# EasyEDA Pro project ProProject_BackupProjects_martinnohr_personal_1_20240117_2024-01-16.epro

# Schematic MIW PS on PCB

## Sheets
1 TTGO_CIRCUIT_PCB_UNIFIED
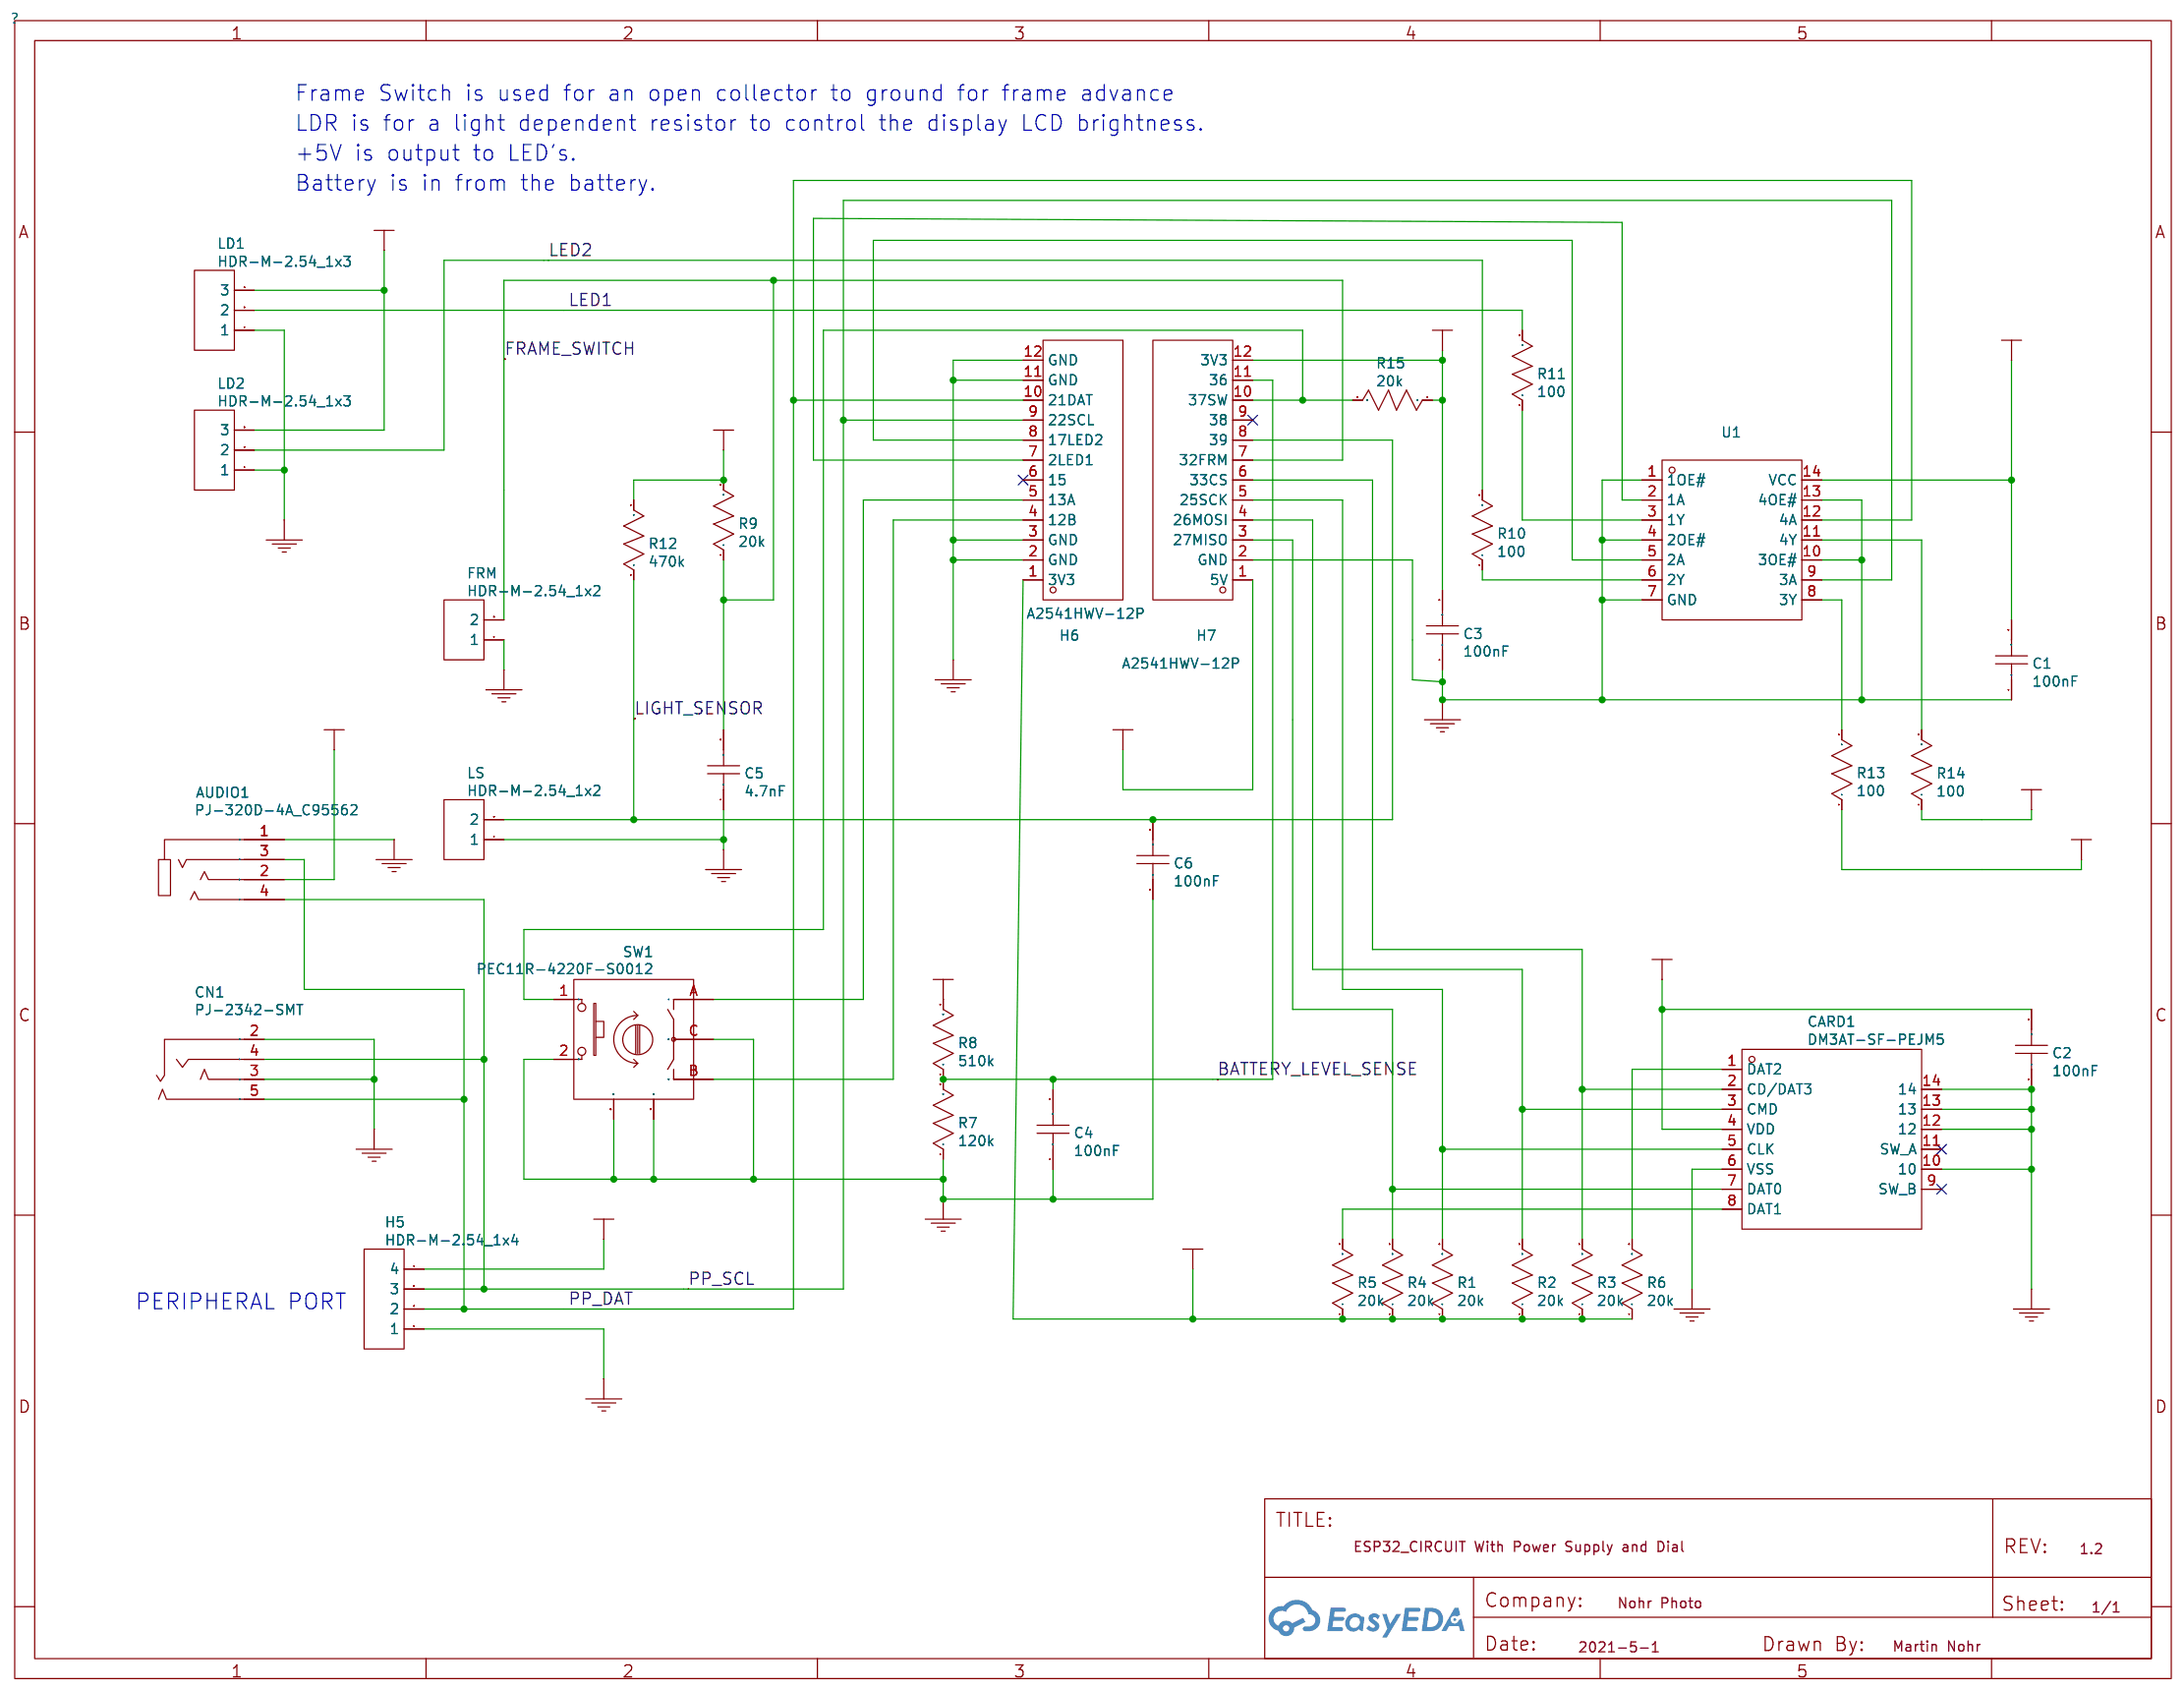
[diagram p0: TTGO_CIRCUIT_PCB_UNIFIED]
2 Power Supply Circuit
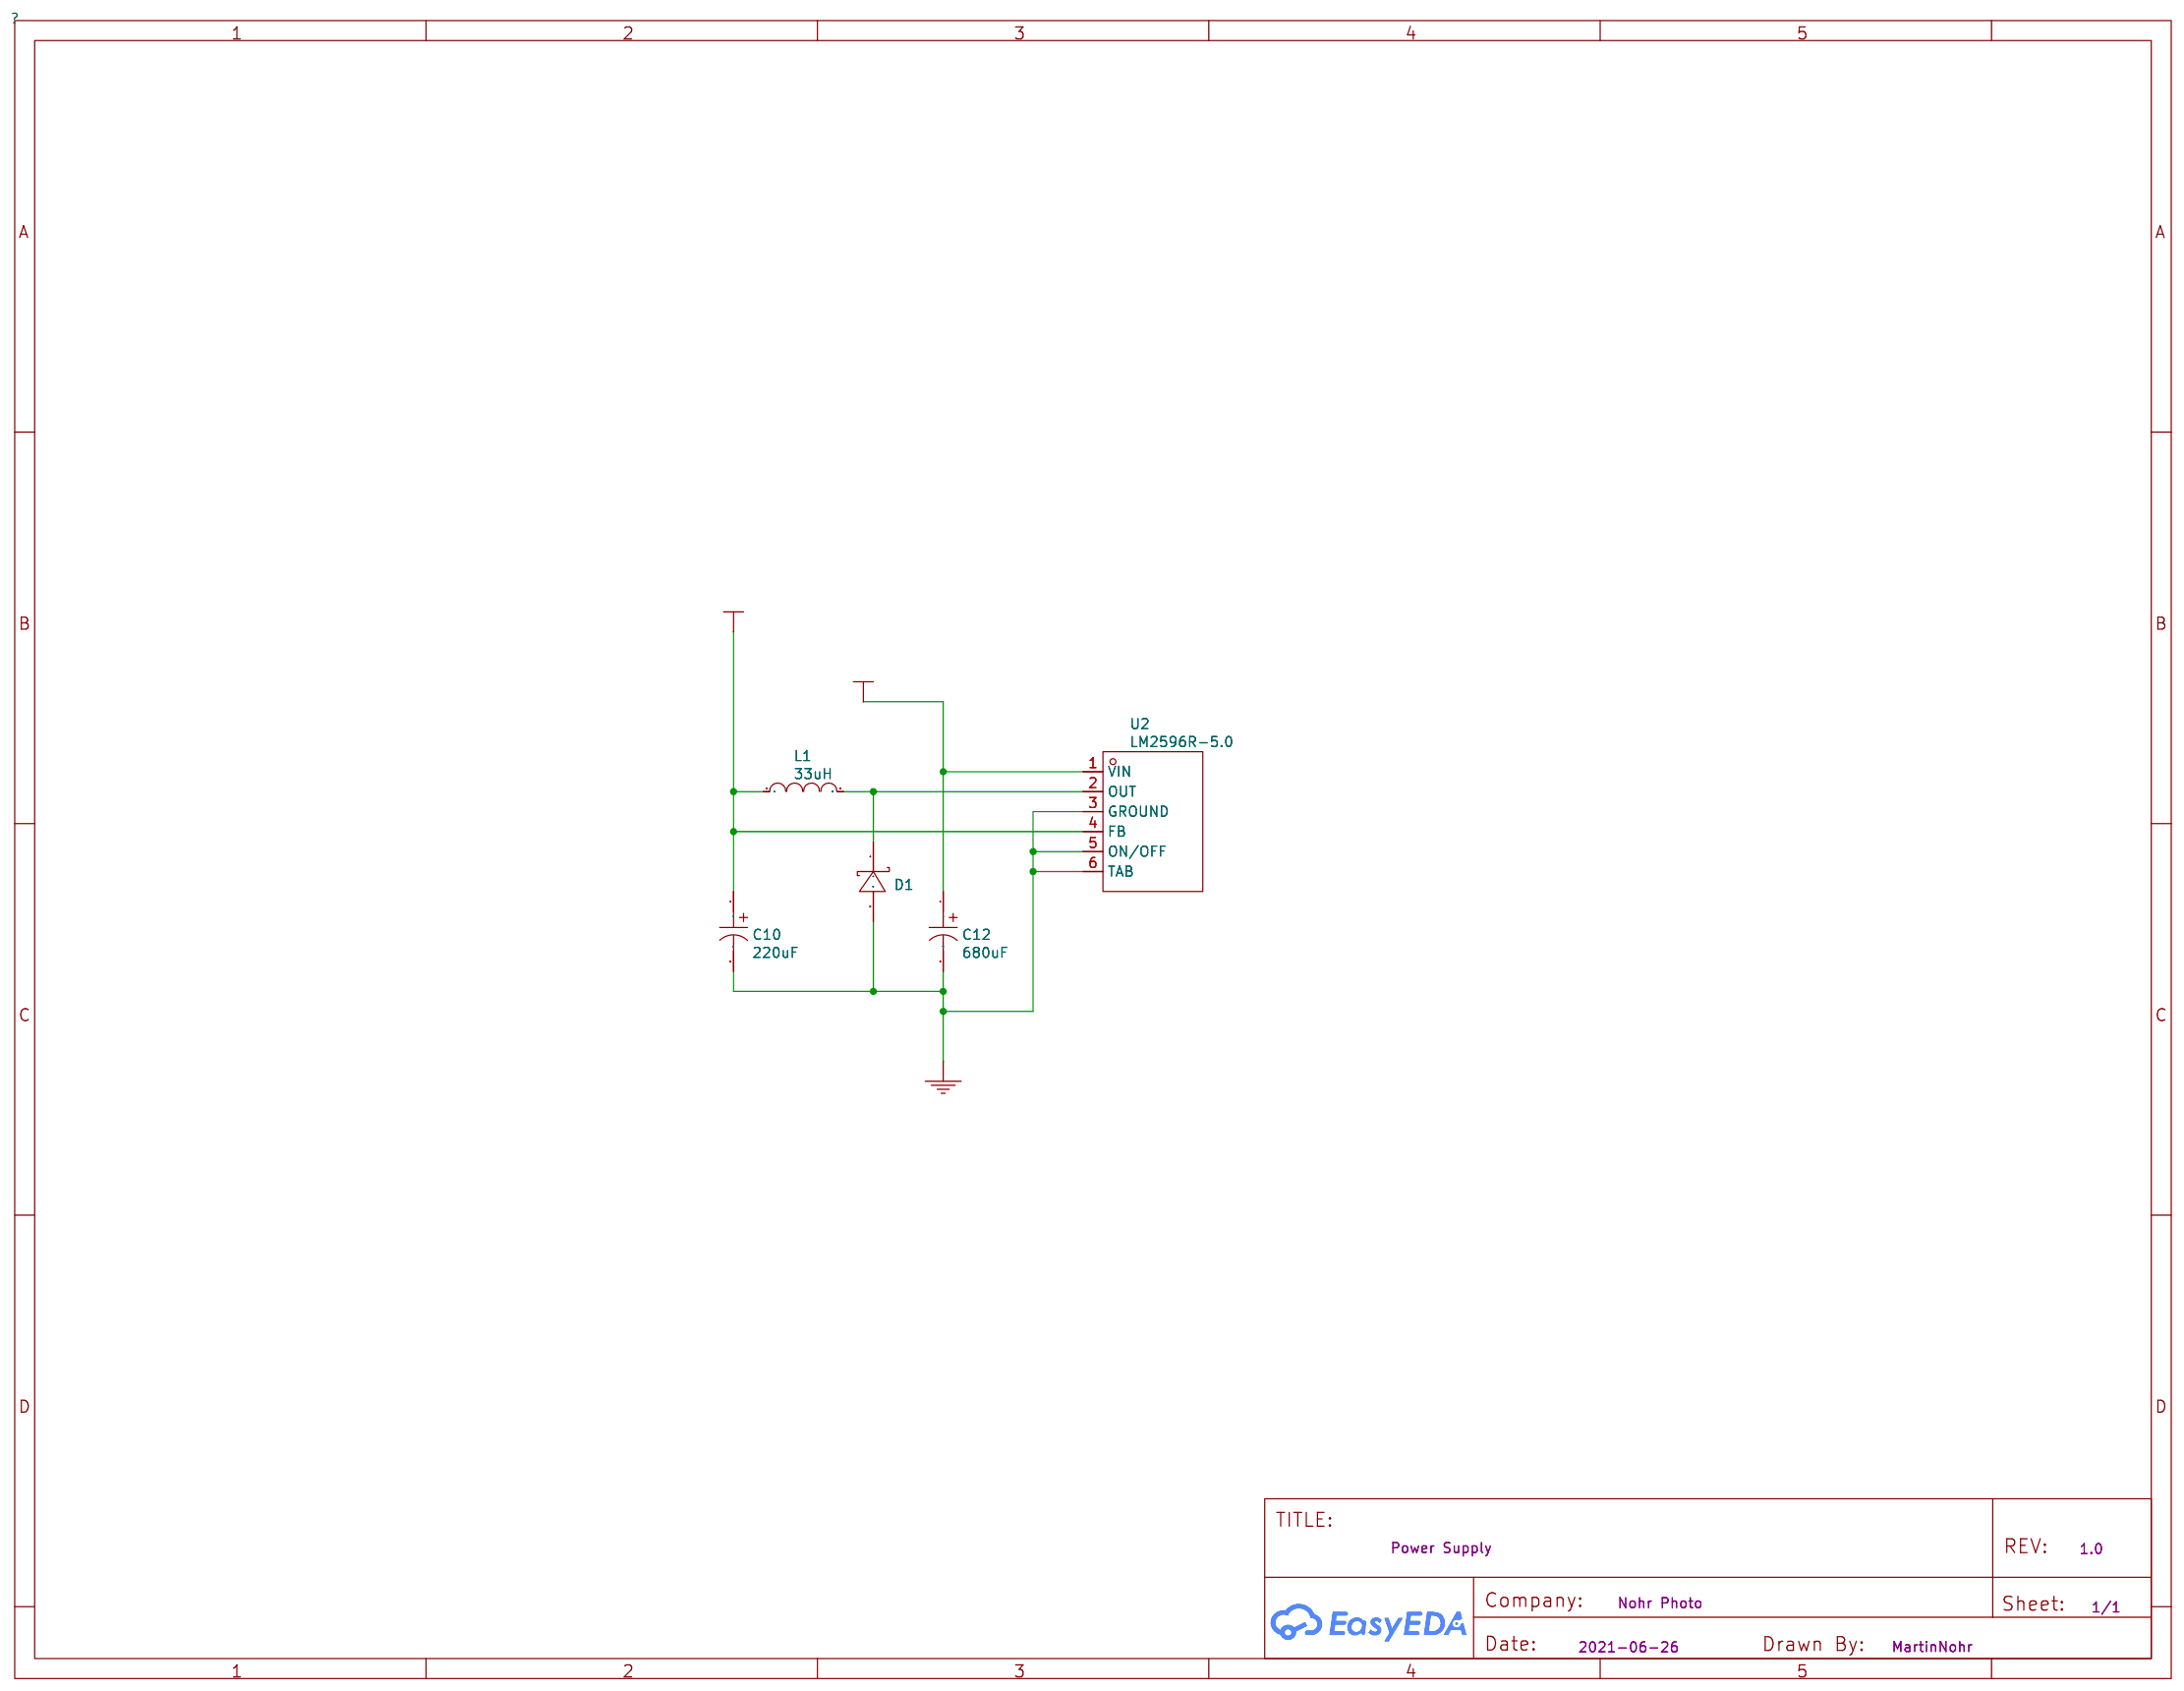
[diagram p1: Power Supply Circuit]

## Parts
sheet Power Supply Circuit
C10  220uF  [CAP-TH_BD5.0-P2.00-D0.8-FD]
C12  680uF  [CAP-TH_BD8.0-P3.50-D0.6-FD]
D1  B2100-13-F  [SMB_L4.6-W3.6-LS5.3-RD]
L1  33uH  [IND-SMD_L11.5-W10.0_SMMS1040]
U2  LM2596R-5.0  [TO-263-5_L10.2-W8.6-P1.70-LS14.4-TL]
sheet TTGO_CIRCUIT_PCB_UNIFIED
AUDIO1  PJ-320D-4A_C95562  [AUDIO-SMD_PJ-320D-4A]
C1  100nF  [C0603]
C2  100nF  [C0603]
C3  100nF  [C0603]
C4  100nF  [C0603]
C5  4.7nF  [C0603]
C6  100nF  [C0603]
CARD1  DM3AT-SF-PEJM5  [SD-SMD_DM3AT-SF-PEJM5]
CN1  PJ-2342-SMT  [AUDIO-SMD_PJ-2342-SMT]
FRM  HDR-M-2.54_1x2  [HDR-M-2.54_1X2]  (no BOM)
H5  HDR-M-2.54_1x4  [HDR-M-2.54_1X4]  (no BOM)
H6  A2541HWV-12P  [HDR-TH_12P-P2.54-V_A2541HWV-12P]
H7  A2541HWV-12P  [HDR-TH_12P-P2.54-V_A2541HWV-12P]
LD1  HDR-M-2.54_1x3  [HDR-M-2.54_1X3]  (no BOM)
LD2  HDR-M-2.54_1x3  [HDR-M-2.54_1X3]  (no BOM)
LS  HDR-M-2.54_1x2  [HDR-M-2.54_1X2]  (no BOM)
R1  20k  [R0603]
R2  20k  [R0603]
R3  20k  [R0603]
R4  20k  [R0603]
R5  20k  [R0603]
R6  20k  [R0603]
R7  120k  [R0603]
R8  510k  [R0603]
R9  20k  [R0603]
R10  100  [R0603]
R11  100  [R0603]
R12  470k  [R0603]
R13  100  [R0603]
R14  100  [R0603]
R15  20k  [R0603]
SW1  PEC11R-4220F-S0012  [SW-TH_PEC11R-4XXXF-SXXXX]
U1  74HCT125PW,112  [TSSOP-14_L5.0-W4.4-P0.65-LS6.4-BL]

## Library data of the parts
C10 = 220uF: link: https://item.szlcsc.com/44805.html; 3DModel: CAP-TH_D5.0×H7.0×P2.0; Supplier: LCSC; Supplier Part: C43340; Manufacturer: ValuePro; Manufacturer Part: KS227M016E07RR0VH2FP0; JLCPCB Part Class: Extended Part
C12 = 680uF: link: https://atta.szlcsc.com/upload/public/pdf/source/20151029/1457707523808.pdf; 3DModel: CAP-TH_D8.0-H8.0-P3.50; Supplier: LCSC; Supplier Part: C698148; Manufacturer: Yunxing; Manufacturer Part: SPT1EM681F12OR; JLCPCB Part Class: Extended Part
D1 = B2100-13-F: link: https://item.szlcsc.com/288502.html; Supplier: LCSC; Manufacturer: DIODES; Supplier Part: C110479; JLCPCB Part Class: Extended Part
L1 = 33uH: link: https://item.szlcsc.com/160923.html; 3DModel: IND-SMD_L11.5-W10.0-H4.0; Supplier: LCSC; Supplier Part: C497900; Manufacturer: YJYCOIN; Manufacturer Part: YSPI1050-330M
U2 = LM2596R-5.0: link: https://item.szlcsc.com/139878.html; 3DModel: TO-263-5-5P_L10.2-W8.7-H4.5-LS14.4-P1.70; Supplier: LCSC; Manufacturer: HTC; Supplier Part: C77782; JLCPCB Part Class: Extended Part
AUDIO1 = PJ-320D-4A_C95562: link: https://atta.szlcsc.com/upload/public/pdf/source/20191118/C95562_44BBA17C3716211451436BE670A801EE.pdf; 3DModel: AUDIO-SMD_L12.1-W6.1-H5.0-4P; Supplier: LCSC; Supplier Part: C95562; Manufacturer: Rectangular Connectors - Contacts; Manufacturer Part: PJ-320D-4A; JLCPCB Part Class: Extended Part
C1-C4 C6 = 100nF: link: https://item.szlcsc.com/362304.html; 3DModel: C0603_L1.6-W0.8-H0.8; Supplier: LCSC; Supplier Part: C15725; Manufacturer: SAMSUNG; Manufacturer Part: CL10B104KC8NNNC
C5 = 4.7nF: Supplier: LCSC; Supplier Part: C106218; Manufacturer: YAGEO; Manufacturer Part: CC0603KRX7R9BB472
CARD1 = DM3AT-SF-PEJM5: Supplier: LCSC; Supplier Part: C114218; Manufacturer: Hirose; link: https://item.szlcsc.com/115458.html
CN1 = PJ-2342-SMT: link: https://item.szlcsc.com/378934.html; 3DModel: AUDIO-SMD_L10.0-W5.0-H3.3-4P; Supplier: LCSC; Supplier Part: C397356; Manufacturer: XKB Enterprise; JLCPCB Part Class: Extended Part
FRM LS = HDR-M-2.54_1x2: Supplier Part: C124375; Supplier: LCSC
H5 = HDR-M-2.54_1x4: Supplier Part: C124378; Supplier: LCSC
H6 H7 = A2541HWV-12P: Supplier: LCSC; Supplier Part: C225509; Manufacturer: Changjiang Connectors; JLCPCB Part Class: Extend; 3DModel: 12SIP-Header
LD1 LD2 = HDR-M-2.54_1x3: Supplier Part: C180248; Supplier: LCSC
R1-R6 R9 R15 = 20k: link: https://item.szlcsc.com/137208.html; 3DModel: R0603_L1.6-W0.8-H0.8; Supplier Part: C4184; Supplier: LCSC; Manufacturer Part: 0603WAF2002T5E; Manufacturer: UniOhm
R7 = 120k: link: https://item.szlcsc.com/137208.html; 3DModel: R0603_L1.6-W0.8-H0.8; Supplier Part: C25808; Supplier: LCSC; Manufacturer Part: 0603WAF1203T5E; Manufacturer: UniOhm
R8 = 510k: link: https://item.szlcsc.com/137208.html; 3DModel: R0603_L1.6-W0.8-H0.8; Supplier Part: C23192; Supplier: LCSC; Manufacturer Part: 0603WAF5103T5E; Manufacturer: UniOhm
R10 R11 R13 R14 = 100: link: https://item.szlcsc.com/137208.html; 3DModel: R0603_L1.6-W0.8-H0.8; Supplier Part: C22775; Supplier: LCSC; Manufacturer Part: 0603WAF1000T5E; Manufacturer: UniOhm
R12 = 470k: link: https://item.szlcsc.com/137208.html; 3DModel: R0603_L1.6-W0.8-H0.8; Supplier Part: C23178; Supplier: LCSC; Manufacturer Part: 0603WAF4703T5E; Manufacturer: UniOhm
SW1 = PEC11R-4220F-S0012: Supplier: LCSC; Supplier Part: C143817; Manufacturer: BOURNS
U1 = 74HCT125PW,112: link: https://item.szlcsc.com/8137.html; 3DModel: TSSOP-14_L5.0-W4.4-H1.0-LS6.4-P0.65; Supplier: LCSC; Supplier Part: C545657; Manufacturer: Nexperia; JLCPCB Part Class: Extended Part

## Nets
+5V: C1.2 C10.1 H7.1(5V) L1.1 LD1.3 LD2.3 U1.14(VCC) U2.4(FB)
GND: AUDIO1.1 C1.1 C2.1 C3.1 C4.1 C5.1 C6.1 C10.2 C12.2 CARD1.6(VSS) CARD1.10 CARD1.12 CARD1.13 CARD1.14 CN1.2 CN1.3 D1.2 FRM.1 H5.1 H6.2(GND) H6.3(GND) H6.11(GND) H6.12(GND) H7.2(GND) LD1.1 LD2.1 LS.1 R7.1 SW1.2 SW1.C SW1.MT1 SW1.MT2 U1.1(1OE#) U1.4(2OE#) U1.7(GND) U1.10(3OE#) U1.13(4OE#) U2.3(GROUND) U2.5(ON/OFF) U2.6(TAB)
VCC: AUDIO1.2 C2.2 C3.2 CARD1.4(VDD) H5.4 H6.1(3V3) H7.12(3V3) R1.1 R2.1 R3.1 R4.1 R5.1 R6.1 R9.2 R12.2 R15.1
BATTERY: C12.1 R8.2 U2.1(VIN)
BATTERY_LEVEL_SENSE: C4.2 H7.11(36) R7.2 R8.1
FRAME_SWITCH: C5.2 FRM.2 H7.7(32FRM) R9.1
LED1: LD1.2 R11.2
LED2: LD2.2 R10.2
LED3: R13.1
LED4: R14.1
LIGHT_SENSOR: C6.2 H7.8(39) LS.2 R12.1
PP_DAT: AUDIO1.3 CN1.5 H5.2 H6.10(21DAT) U1.12(4A)
PP_SCL: AUDIO1.4 CN1.4 H5.3 H6.9(22SCL) U1.9(3A)
CARD1_1: CARD1.1(DAT2) R6.2
CARD1_2: CARD1.2(CD/DAT3) H7.6(33CS) R3.2
CARD1_3: CARD1.3(CMD) H7.4(26MOSI) R2.2
CARD1_5: CARD1.5(CLK) H7.5(25SCK) R1.2
CARD1_7: CARD1.7(DAT0) H7.3(27MISO) R4.2
CARD1_8: CARD1.8(DAT1) R5.2
H6_7: H6.7(2LED1) U1.2(1A)
H6_8: H6.8(17LED2) U1.5(2A)
R10_1: R10.1 U1.6(2Y)
R11_1: R11.1 U1.3(1Y)
SW1_1: H7.10(37SW) R15.2 SW1.1
SW1_A: H6.5(13A) SW1.A
SW1_B: H6.4(12B) SW1.B
U1_8: R13.2 U1.8(3Y)
U1_11: R14.2 U1.11(4Y)
U2_2: D1.1 L1.2 U2.2(OUT)

Not connected (* = marked no-connect by the designer): CARD1 9(SW_B)* 11(SW_A)*; H6 6(15)*; H7 9(38)*

## Notes on the sheets
sheet 1
- Frame Switch is used for an open collector to ground for frame advance
- LDR is for a light dependent resistor to control the display LCD brightness.
- +5V is output to LED's.
- Battery is in from the battery.
- PERIPHERAL PORT

# Board 1-PCB_TTGO MIW PCB UNIFIED
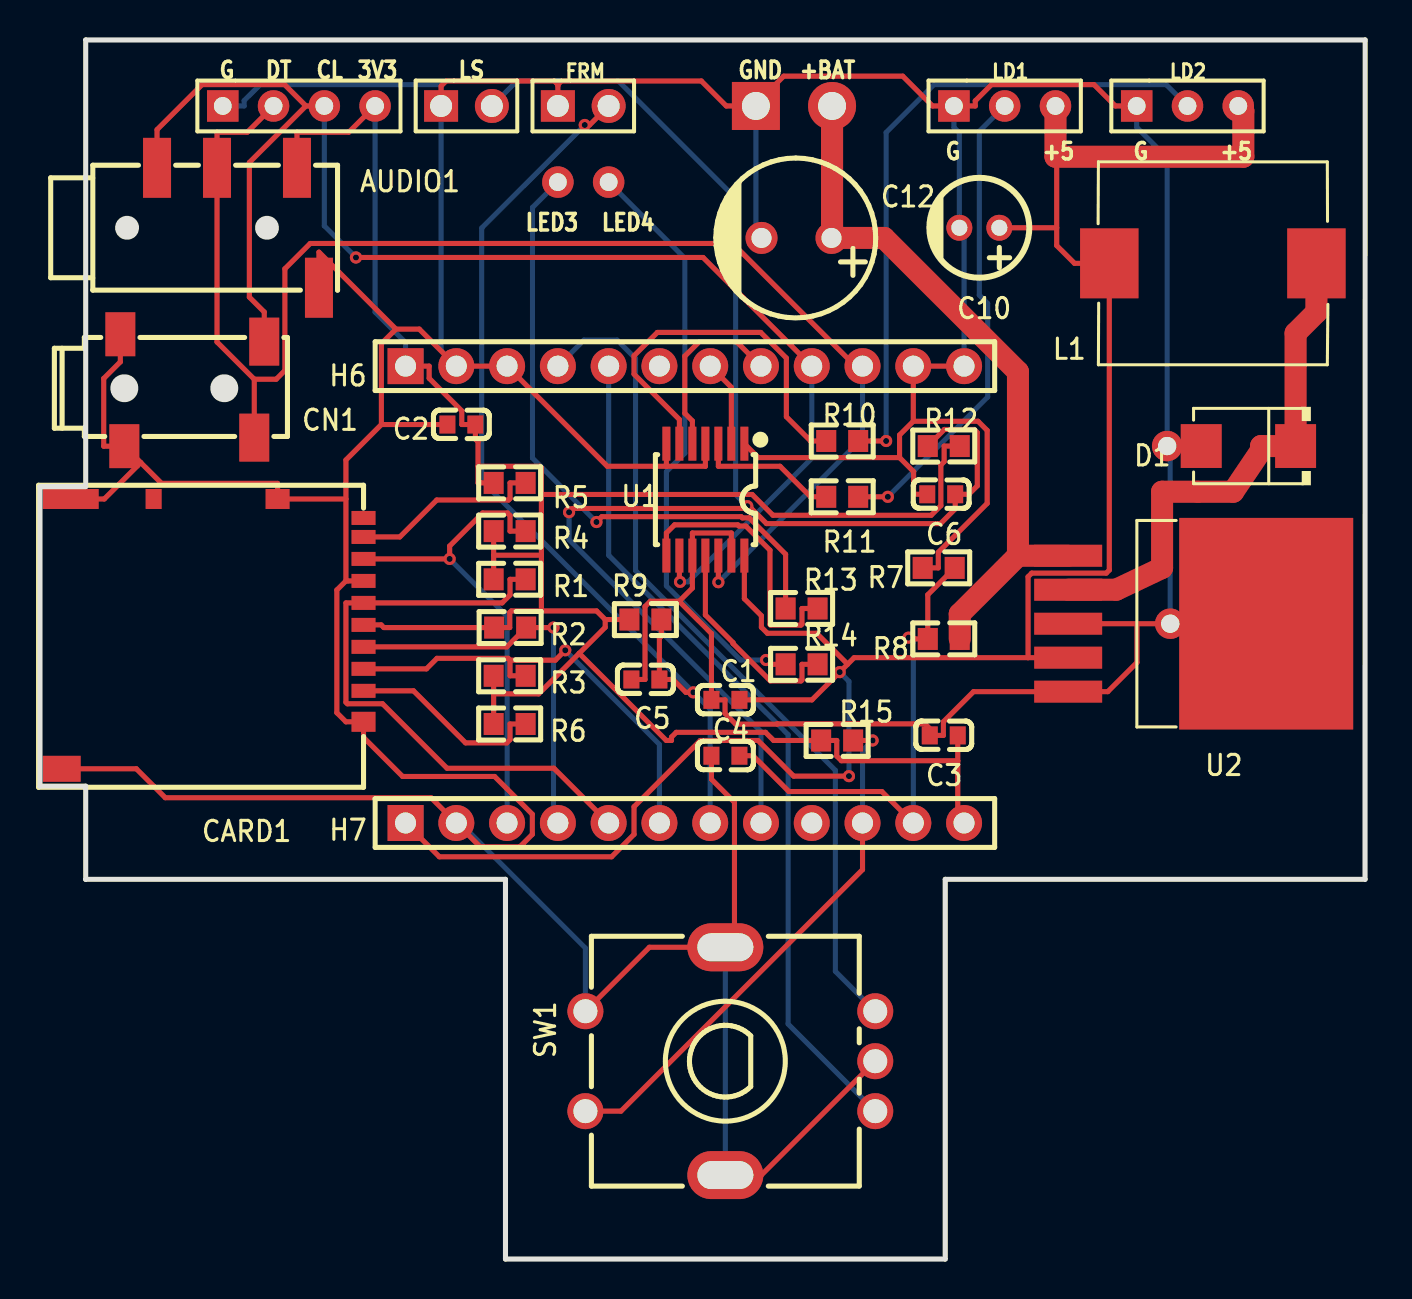
[diagram p2: board, top side]
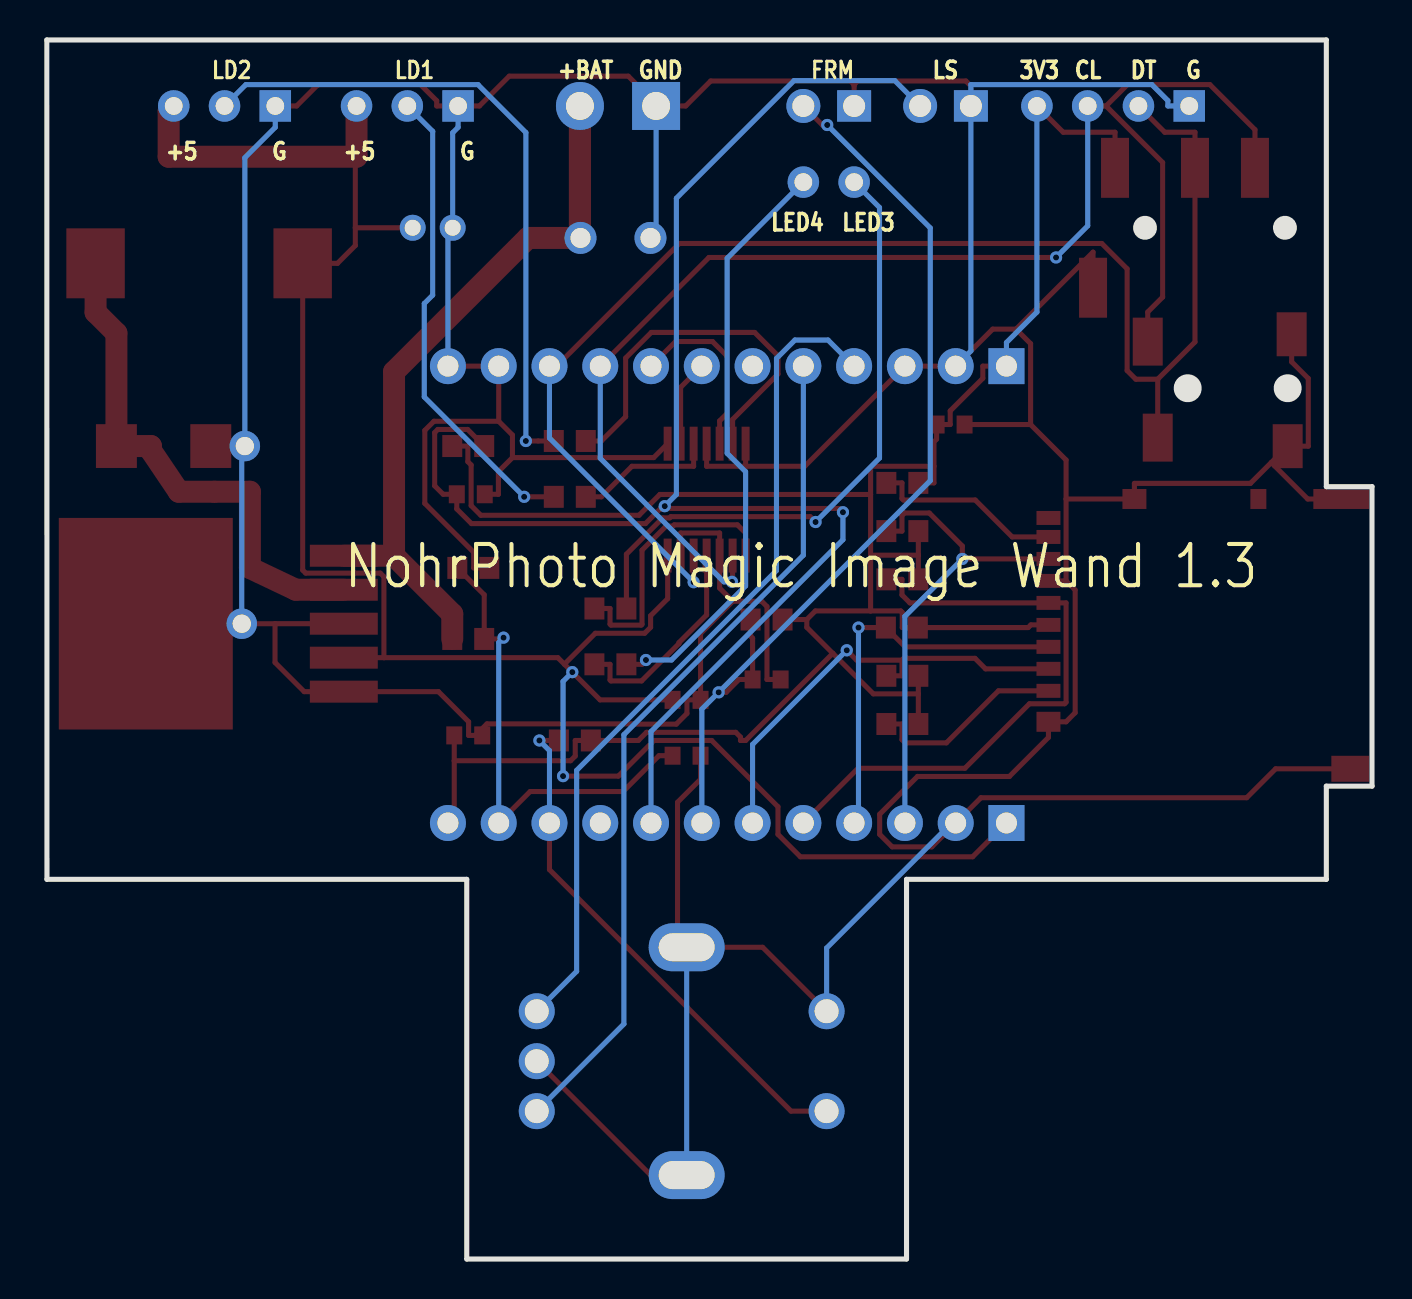
[diagram p3: board, bottom side, seen from below]

Outline 66.29 x 61 mm; copper layers: Top Layer, Bottom Layer. Coordinates in mm from the lower left corner of the outline.
Outline path: 0,38.65 2.29,38.65 2.29,61 66.29,61 66.29,19 45.29,19 45.29,0 23.29,0 23.29,19 2.29,19 2.29,23.66 0,23.66 0,38.65
Stack: Top Layer 0.035mm / Dielectric1 1.51mm FR4 er 4.5 / Bottom Layer 0.035mm

## Design rules (mm)
spacing Default (default): track to track 0.152, other pairs 0 to 0.152
spacing BATTERY: track to track 0.152, other pairs 0 to 0.152
track width Default (default): min 0.254, default 0.254, max 25.4
track width BATTERY: min 1.1, default 1.1, max 25.4
differential pair differentialPair (default): width min 0.127, default 0.254, max 2.54; gap min 0.152, default 0.152
via Default (default): diameter min 0.61, default 0.61, max 100.025; hole min 0.305, default 0.305, max 59.995
via BATTERY: diameter min 0.61, default 0.61, max 100.025; hole min 0.305, default 0.305, max 59.995
net BATTERY uses BATTERY
net U2_2 uses BATTERY
net +5V uses gge72262
pour e88 uses gge72257
pour e535 uses gge72262

## Placement (name value [footprint] x y rotation side)
AUDIO1  PJ-320D-4A_C95562  [AUDIO-SMD_PJ-320D-4A]  9.91 51.6 90 top
C1  100nF  [C0603]  34.29 27.98 0 top
C2  100nF  [C0603]  21.08 41.76 0 top
C3  100nF  [C0603]  45.21 26.2 0 top
C4  100nF  [C0603]  34.29 25.19 0 top
C5  4.7nF  [C0603]  30.29 29 0 top
C6  100nF  [C0603]  45.09 38.27 0 top
C10  220uF  [CAP-TH_BD5.0-P2.00-D0.8-FD]  46.99 51.6 180 top
C12  680uF  [CAP-TH_BD8.0-P3.50-D0.6-FD]  37.85 51.09 180 top
CARD1  DM3AT-SF-PEJM5  [SD-SMD_DM3AT-SF-PEJM5]  8.64 31.28 270 top
CN1  PJ-2342-SMT  [AUDIO-SMD_PJ-2342-SMT]  7.62 43.47 90 top
D1  B2100-13-F  [SMB_L4.6-W3.6-LS5.3-RD]  60.45 40.68 180 top
FRM  HDR-M-2.54_1x2  [HDR-M-2.54_1X2]  27.18 57.7 0 top
H5  HDR-M-2.54_1x4  [HDR-M-2.54_1X4]  12.95 57.7 0 top
H6  A2541HWV-12P  [HDR-TH_12P-P2.54-V_A2541HWV-12P]  32.26 44.68 0 top
H7  A2541HWV-12P  [HDR-TH_12P-P2.54-V_A2541HWV-12P]  32.26 21.82 0 top
L1  33uH  [IND-SMD_L11.5-W10.0_SMMS1040]  58.67 49.82 180 top
LD1  HDR-M-2.54_1x3  [HDR-M-2.54_1X3]  48.26 57.7 0 top
LD2  HDR-M-2.54_1x3  [HDR-M-2.54_1X3]  57.4 57.7 0 top
LS  HDR-M-2.54_1x2  [HDR-M-2.54_1X2]  21.34 57.7 0 top
NOREF  -  [Pad_e948]  39.62 57.7 0 top
NOREF#2  -  [Pad_e950]  25.91 53.89 0 top
NOREF#3  -  [Pad_e953]  56.54 31.79 0 top
NOREF#4  -  [Pad_e949]  35.81 57.7 0 top
NOREF#5  -  [Pad_e952]  56.39 40.68 0 top
NOREF#6  -  [Pad_e951]  28.45 53.89 0 top
R1  20k  [R0603]  23.5 34.01 0 top
R2  20k  [R0603]  23.52 31.6 0 top
R3  20k  [R0603]  23.5 29.18 0 top
R4  20k  [R0603]  23.5 36.42 0 top
R5  20k  [R0603]  23.5 38.84 0 top
R6  20k  [R0603]  23.5 26.77 0 top
R7  120k  [R0603]  44.96 34.58 0 top
R8  510k  [R0603]  45.21 31.03 0 top
R9  20k  [R0603]  30.29 32 180 top
R10  100  [R0603]  40.13 40.93 0 top
R11  100  [R0603]  40.13 38.14 0 top
R12  470k  [R0603]  45.21 40.68 0 top
R13  100  [R0603]  38.1 32.55 0 top
R14  100  [R0603]  38.1 29.76 0 top
R15  20k  [R0603]  39.88 25.95 0 top
SW1  PEC11R-4220F-S0012  [SW-TH_PEC11R-4XXXF-SXXXX]  34.53 9.9 90 top
U1  74HCT125PW,112  [TSSOP-14_L5.0-W4.4-P0.65-LS6.4-BL]  33.29 38 180 top
U2  LM2596R-5.0  [TO-263-5_L10.2-W8.6-P1.70-LS14.4-TL]  56.39 31.79 0 top

## Footprints (pads in the part's own frame, mm; a bottom-side part is the same pattern mirrored in y, then rotated)
AUDIO-SMD_PJ-320D-4A
  rect 3x1.4 smd: 1(-3,-4.05) 2(3,-2.95) 3(3,1.05) 4(3,4.05)
AUDIO-SMD_PJ-2342-SMT
  rect 2.2x1.5 smd: 2(-2.8,3.4) 3(2.8,3.6)
  rect 2.4x1.5 smd: 4(2.432,-3.6) 5(-2.372,-3.1)
C0603
  rect 0.8x0.9 smd: 1(-0.7,0) 2(0.7,0)
CAP-TH_BD5.0-P2.00-D0.8-FD
  round 1.3 hole 0.8: 1(-1,0) 2(1,0)
CAP-TH_BD8.0-P3.50-D0.6-FD
  round 1.6 hole 1: 1(-1.75,0) 2(1.75,0)
HDR-M-2.54_1X2
  rect 1.7x1.575 hole 1.1: 1(-1.27,0)
  round 1.7 hole 1.1: 2(1.27,0)
HDR-M-2.54_1X3
  rect 1.575x1.575 hole 0.889: 1(-2.54,0)
  round 1.575 hole 0.889: 2(0,0) 3(2.54,0)
HDR-M-2.54_1X4
  rect 1.575x1.575 hole 0.889: 1(-3.81,0)
  round 1.575 hole 0.889: 2(-1.27,0) 3(1.27,0) 4(3.81,0)
HDR-TH_12P-P2.54-V_A2541HWV-12P
  rect 1.8x1.8 hole 1.05: 1(-13.97,0)
  round 1.8 hole 1.05: 2(-11.43,0) 3(-8.89,0) 4(-6.35,0) 5(-3.81,0) 6(-1.27,0) 7(1.27,0) 8(3.81,0) 9(6.35,0) 10(8.89,0) 11(11.43,0) 12(13.97,0)
IND-SMD_L11.5-W10.0_SMMS1040
  rect 2.924x3.5 smd: 1(5.181,0) 2(-5.181,0)
Pad_e948
  round 2.4 hole 1.4: 1(0,0)
Pad_e949
  rect 2.4x2.4 hole 1.4: 1(0,0)
Pad_e950
  round 1.575 hole 0.889: 2(0,0)
Pad_e951
  round 1.575 hole 0.889: 2(0,0)
Pad_e952
  round 1.524 hole 0.914: 3(0,0)
Pad_e953
  round 1.524 hole 0.914: 4(0,0)
R0603
  rect 1x1.1 smd: 1(-0.8,0) 2(0.8,0)
SD-SMD_DM3AT-SF-PEJM5
  rect 0.7x1.2 smd: 1(2.85,7.55) 2(1.75,7.55) 3(0.65,7.55) 4(-0.45,7.55) 5(-1.55,7.55) 6(-2.65,7.55) 7(-3.75,7.55) 8(-4.85,7.55) 9(-5.8,7.55)
  rect 1x1.2 smd: 10(-6.75,3.25) 14(4.4,7.55)
  rect 1x0.8 smd: 11(-6.75,-2.95)
  rect 1x2.8 smd: 12(-6.75,-7.1)
  rect 1.3x1.9 smd: 13(6.75,-7.55)
SMB_L4.6-W3.6-LS5.3-RD
  rect 2.047x2.192 smd: 1(-2.361,0) 2(2.361,0)
SW-TH_PEC11R-4XXXF-SXXXX
  round 1.8 hole 1.2: 1(-2.5,7.25) 2(2.5,7.25) A(-2.5,-7.25) B(2.5,-7.25) C(0,-7.25)
  oval 2.4x3.8 hole 1.4x2.8: MT1(-5.7,0.25) MT2(5.7,0.25)
TO-263-5_L10.2-W8.6-P1.70-LS14.4-TL
  rect 3.4x1.1 smd: 1(-4.953,3.4) 2(-4.953,1.7) 3(-4.953,0) 4(-4.953,-1.7) 5(-4.953,-3.4)
  rect 8.705x10.587 smd: 6(4.953,0)
TSSOP-14_L5.0-W4.4-P0.65-LS6.4-BL
  rect 0.4x1.7 smd: 1(-1.95,-2.8) 2(-1.3,-2.8) 3(-0.65,-2.8) 4(0,-2.8) 5(0.65,-2.8) 6(1.3,-2.8) 7(1.95,-2.8) 8(1.95,2.8) 9(1.3,2.8) 10(0.65,2.8) 11(0,2.8) 12(-0.65,2.8) 13(-1.3,2.8) 14(-1.95,2.8)

## Nets
As in the schematic, except:
GND: AUDIO1.1 C1.1 C2.1 C3.1 C4.1 C5.1 C6.1 C10.2 C12.2 CARD1.6 CARD1.10 CARD1.12 CARD1.13 CARD1.14 CN1.2 CN1.3 D1.2 FRM.1 H5.1 H6.2 H6.3 H6.11 H6.12 H7.2 LD1.1 LD2.1 LS.1 NOREF#3.4 NOREF#4.1 NOREF#5.3 R7.1 SW1.2 SW1.C SW1.MT1 SW1.MT2 U1.1 U1.4 U1.7 U1.10 U1.13 U2.3 U2.5 U2.6
BATTERY: C12.1 NOREF.1 R8.2 U2.1
LED3: NOREF#2.2 R13.1
LED4: NOREF#6.2 R14.1

Pads without a net: CARD1 9 11; H6 6; H7 9

## Via types
v1: diameter 0.61, hole 0.305, Top Layer to Bottom Layer, 18 vias

## Routing (per net, layer and track width the routed paths; a pad name or vN(x,y) marks a point on that pad's centre or on a via; arc(x,y) is an arc through that point)
+5V: length 121.7
  Top Layer w0.254: 49.43,30.09 49.43,34.14 49.61,34.32 53.34,34.32 53.49,34.47 L1.1 51.75,49.82 50.86,50.71 50.86,51.6 ; 49.43,30.09 40.73,30.09 40.4,29.76 ; 49.43,30.09 U2.4 ; LD2.3 60.2,57.44 60.2,55.16 50.86,55.16 ; 35.24,35.2 35.24,33.04 36.09,32.19 36.09,31.61 36.39,31.31 38.85,31.31 40.4,29.76 ; 50.86,55.16 50.8,55.16 LD1.3 ; 50.86,55.16 50.86,51.6 ; 40.4,29.76 v1(40.01,29.37) 38.62,27.98 C1.2 ; 50.86,51.6 C10.1 ; H7.1 19.98,20.13 28.6,20.13 29.72,21.25 29.72,22.63 33.03,25.95 35.92,25.95 37.7,24.16 v1(40.47,24.16)
  Top Layer w1.1: LD1.3 50.8,55.16 60.2,55.16 60.2,57.44 LD2.3
  Bottom Layer w0.254: v1(40.01,29.37) 40.47,28.9 v1(40.47,24.16)
GND: length 367.2
  Top Layer w0.254: 17.08,41.76 17.08,45.8 17.81,46.53 ; 17.08,41.76 15.31,39.98 15.31,38.03 ; 17.08,41.76 C2.1 ; 31.98,32.91 30.53,32.91 30.27,32.65 30.27,29 C5.1 ; 31.98,32.91 32.64,33.57 32.64,36.33 34.59,36.33 34.59,35.2 ; 31.98,32.91 33.59,31.3 C1.1 34.27,27.98 34.27,27.3 34.8,26.77 36.88,26.77 36.9,26.78 44.28,26.78 44.85,26.2 ; 44.85,26.2 45.19,26.2 45.19,26.88 46.7,28.39 53.42,28.39 54.88,29.85 54.88,31.79 NOREF#3.4 ; 44.85,26.2 C3.1 ; D1.2 NOREF#5.3 ; C4.1 33.59,24.01 34.74,22.86 34.74,16.06 SW1.MT2 30.49,15.6 SW1.2 ; 35.24,40.8 35.93,40.1 43,40.1 ; 15.31,33.93 14.85,33.48 14.85,27.34 15.31,26.88 CARD1.14 16.19,26.1 18.14,24.15 22.74,24.15 24.63,22.26 24.63,21.25 24.01,20.63 22.02,20.63 H7.2 19.56,23.08 6.27,23.08 4.82,24.53 CARD1.13 ; 15.31,33.93 15.31,38.03 ; 15.31,33.93 CARD1.6 ; 31.34,39.67 33.29,39.67 33.29,40.8 ; 31.34,39.67 28.38,39.67 H6.3 H6.2 18.97,46.53 17.81,46.53 ; 31.34,39.67 31.34,40.8 ; U2.6 56.54,31.79 ; LS.1 20.07,58.7 20.32,58.95 25.73,58.95 25.91,58.77 ; 15.31,38.03 CARD1.10 11.89,38.81 6.08,38.81 5.04,39.85 ; CN1.3 4.02,44.89 3.19,44.06 3.19,40.67 CN1.2 5.04,39.85 ; 43.69,41.92 46.93,41.92 47.38,41.46 47.38,37.81 44.94,35.36 44.94,34.58 R7.1 ; 43.69,41.92 H6.11 H6.12 ; 43.69,41.92 43,41.23 43,40.1 ; 25.91,58.77 FRM.1 ; 25.91,58.77 26.09,58.95 33.08,58.95 34.33,57.7 35.71,57.7 ; 5.04,39.85 3.22,38.03 CARD1.12 ; NOREF#4.1 35.71,57.7 ; 35.71,57.7 37.2,59.19 43.16,59.19 44.65,57.7 LD1.1 46.79,57.7 46.79,57.96 47.6,58.77 52.73,58.77 53.8,57.7 LD2.1 ; U2.3 54.88,31.79 ; 43,40.1 43.7,39.4 43.7,38.27 C6.1 ; SW1.C 36.09,4.2 SW1.MT1 ; AUDIO1.1 13.96,50.38 17.81,46.53
  Bottom Layer w0.254: C12.2 35.81,51.38 NOREF#4.1 ; H5.1 10.21,57.7 10.21,57.96 11.01,58.77 20.07,58.77 LS.1 20.07,45.44 H6.2 ; SW1.2 27.28,15.56 21.03,21.82 H7.2 ; LD2.1 54.86,56.63 56.39,55.11 NOREF#5.3 56.54,40.53 NOREF#3.4 ; SW1.MT1 SW1.MT2 ; H6.12 46.23,51.37 C10.2 45.99,56.36 45.72,56.63 LD1.1
VCC: length 119.4
  Top Layer w0.254: 26.97,30.31 31.33,25.95 31.59,25.95 31.59,26.12 31.83,26.36 36.29,26.36 36.7,25.95 R15.1 39.86,25.95 39.86,25.17 40.09,24.93 45.91,24.93 ; 26.97,30.31 24.95,28.28 22.69,28.28 ; 26.97,30.31 28.28,31.61 28.28,32 ; 21.91,39.67 25.01,39.67 25.08,39.59 25.08,38.26 ; 21.91,39.67 21.91,40.89 21.78,41.03 C2.2 21.1,41.76 21.1,42.44 19.47,44.07 19.47,44.68 H6.1 ; 21.91,39.67 21.91,38.84 R5.1 ; AUDIO1.2 12.86,56.38 15.45,56.38 H5.4 ; R9.2 28.28,32 ; H7.12 45.91,22.13 45.91,24.93 ; 25.08,38.26 35.62,38.26 36.67,37.22 44.58,37.22 45.07,37.7 45.07,39.73 45.23,39.9 45.23,40.68 R12.2 ; 25.08,38.26 25.08,35.22 ; 25.08,32.43 25.08,35.22 ; 25.08,32.43 23.57,32.43 23.5,32.36 23.5,31.6 R2.1 17.2,31.6 17.07,31.73 CARD1.4 ; 25.08,32.43 27.85,32.43 28.28,32 ; 25.08,35.22 22.69,35.22 ; R3.1 22.69,28.28 ; 22.69,28.28 R6.1 ; C3.2 45.91,24.93 ; 22.69,35.22 R4.1 ; 22.69,35.22 R1.1
  Bottom Layer w0.254: H6.1 18.29,45.86 16.76,47.38 H5.4
BATTERY: length 42.4
  Top Layer w1.1: 39.62,51.12 NOREF.1 39.62,51.12 ; 39.62,51.12 C12.1 ; 39.62,51.12 C12.1 ; C12.1 42.23,51.09 48.92,44.4 48.92,35.19 ; R8.2 46.01,32.28 48.92,35.19 ; 48.92,35.19 U2.1
BATTERY_LEVEL_SENSE: length 24.6
  Top Layer w0.254: H7.11 42.11,23.39 37.46,23.39 35.67,25.19 C4.2 ; R7.2 44.41,33.24 R8.1 43.63,31.03 43.57,31.09 v1(43.45,31.09)
  Bottom Layer w0.254: H7.11 43.69,30.85 v1(43.45,31.09)
CARD1_1: length 10
  Top Layer w0.254: CARD1.1 18.69,28.43 21.29,25.83 23.35,25.83 23.51,25.99 23.51,26.77 R6.2
CARD1_2: length 22.7
  Top Layer w0.254: 23.51,29.97 23.51,29.18 R3.2 ; 23.51,29.97 23.42,30.06 19.86,30.06 19.33,29.53 CARD1.2 ; 23.51,29.97 25.78,29.97 v1(26.28,30.46)
  Bottom Layer w0.254: v1(26.28,30.46) 30.99,25.75 H7.6
CARD1_3: length 19.8
  Top Layer w0.254: CARD1.3 23.35,30.63 R2.2 v1(25.69,31.6)
  Bottom Layer w0.254: v1(25.69,31.6) 25.69,22.04 H7.4
CARD1_5: length 30.6
  Top Layer w0.254: R1.2 23.51,34.01 23.51,33.23 23.12,32.83 CARD1.5 15.31,32.83 15.31,27.86 15.38,27.78 17.14,27.78 20.36,24.56 25.71,24.56 H7.5
CARD1_7: length 24.7
  Top Layer w0.254: CARD1.7 v1(20.49,35.03) 20.49,35.68 22.15,37.33 23.39,37.33 23.51,37.21 23.51,36.42 R4.2
  Bottom Layer w0.254: H7.3 23.37,32.16 v1(20.49,35.03)
CARD1_8: length 9.7
  Top Layer w0.254: R5.2 23.51,38.84 23.51,38.06 23.44,37.98 19.85,37.98 18,36.13 CARD1.8
FRAME_SWITCH: length 48.4
  Top Layer w0.254: FRM.2 27.5,56.75 v1(27.25,56.75) ; R9.1 31.09,31.17 30.99,31.07 C5.2 31.67,29 32.31,28.36 v1(32.69,28.36)
  Bottom Layer w0.254: v1(27.25,56.75) 22.1,51.59 22.1,38.94 v1(32.69,28.36) 33.53,27.51 H7.7
H6_7: length 4.3
  Top Layer w0.254: 34.59,40.8 34.59,43.62 H6.7
H6_8: length 9.2
  Top Layer w0.254: 32.64,40.8 32.64,41.94 32.26,42.32 32.26,45.18 32.99,45.91 34.84,45.91 H6.8
LED1: length 23.8
  Top Layer w0.254: R11.2 v1(42.41,38.14)
  Bottom Layer w0.254: v1(42.41,38.14) 47.41,43.13 47.41,47.81 46.99,48.23 46.99,56.43 LD1.2
LED2: length 33.3
  Top Layer w0.254: R10.2 v1(42.33,40.93)
  Bottom Layer w0.254: v1(42.33,40.93) 42.33,56.37 44.73,58.77 56.34,58.77 LD2.2
LED3: length 31.9
  Top Layer w0.254: R13.1 37.3,35.27 35.48,37.09 35.14,37.09 35.08,37.15 28.11,37.15 v1(27.84,36.88)
  Bottom Layer w0.254: v1(27.84,36.88) 24.64,40.08 24.64,52.62 NOREF#2.2
LED4: length 29.8
  Top Layer w0.254: R14.1 36.52,29.76 36.52,29.78 v1(36.32,29.97)
  Bottom Layer w0.254: NOREF#6.2 32.26,50.08 32.26,40.32 31.34,39.4 31.34,33.68 35.04,29.97 v1(36.32,29.97)
LIGHT_SENSOR: length 78
  Top Layer w0.254: 35.38,37.56 35.59,37.56 36.34,36.8 45.05,36.8 45.78,37.54 C6.2 46.47,38.27 46.89,38.69 46.89,41.35 46.73,41.51 45.24,41.51 R12.1 ; 35.38,37.56 v1(35.38,37.67) ; 35.38,37.56 26.65,37.56 v1(26.47,37.37)
  Bottom Layer w0.254: v1(35.38,37.67) 34.8,38.26 34.8,53.08 28.91,58.97 23.88,58.97 LS.2 ; v1(26.47,37.37) 26.47,35.99 36.07,26.39 H7.8
PP_DAT: length 73.3
  Top Layer w0.254: CN1.5 10.72,44.02 ; 10.72,44.02 11.82,44.02 12.25,44.46 12.25,49.55 13.52,50.82 34.65,50.82 40.79,44.68 H6.10 ; 10.72,44.02 8.86,45.89 AUDIO1.3 8.86,56.38 10.37,56.38 H5.2 ; 33.94,35.2 v1(33.94,33.87)
  Bottom Layer w0.254: v1(33.94,33.87) 41.15,41.08 H6.10
PP_SCL: length 73.3
  Top Layer w0.254: 13.3,57.7 10.47,54.87 10.47,48.13 11.22,47.39 CN1.4 ; 13.3,57.7 H5.3 ; 13.3,57.7 12.24,58.77 8.11,58.77 5.86,56.51 AUDIO1.4 ; H6.9 33.17,50.12 v1(15.81,50.12) ; 31.99,35.2 31.99,33.92 v1(32.02,33.88)
  Bottom Layer w0.254: H6.9 38.61,40.07 32.42,33.88 v1(32.02,33.88) ; v1(15.81,50.12) 14.22,51.7 H5.3
R10_1: length 19.4
  Top Layer w0.254: 31.99,40.8 31.99,42.01 29.72,44.28 29.72,45.2 30.88,46.37 36.05,46.37 37.34,45.08 37.34,42.15 38.55,40.93 R10.1
R11_1: length 7.2
  Top Layer w0.254: 33.94,40.8 33.94,39.67 37.02,39.67 38.55,38.14 R11.1
SW1_1: length 26.5
  Top Layer w0.254: v1(41.65,25.95) R15.2 ; SW1.1 29.06,7.4 41.15,19.48 H7.10
  Bottom Layer w0.254: v1(41.65,25.95) 41.15,25.44 H7.10
SW1_A: length 42.8
  Bottom Layer w0.254: SW1.A 37.43,11.76 37.43,26.24 28.45,35.22 H6.5
SW1_B: length 42.4
  Bottom Layer w0.254: H6.4 27.21,45.99 28.87,45.99 29.79,45.06 29.79,34.45 39.79,24.45 39.79,14.4 SW1.B
U1_8: length 13.9
  Top Layer w0.254: 31.34,35.2 31.34,36.33 31.75,36.74 34.91,36.74 34.97,36.68 35.31,36.68 36.52,35.47 36.52,31.76 36.56,31.72 38.07,31.72 38.12,31.77 38.12,32.55 R13.2
U1_11: length 10.8
  Top Layer w0.254: R14.2 38.12,29.76 38.12,28.98 38.07,28.93 36.54,28.93 34.67,30.8 34.67,30.84 33.29,32.23 33.29,35.2
U2_2: length 26.3
  Top Layer w1.1: U2.2 53.84,33.49 56.13,34.58 56.13,38.39 59.69,38.39 61.09,40.46 61.09,40.68 D1.1 62.81,46.33 63.85,47.37 L1.2

## Copper pours and planes (outline as drawn; the poured copper is in the pictures)
+5V on Top Layer: -0.76,-1.25 -0.76,62.02 67.06,62.02 67.31,0.04 0.24,-0.25
GND on Bottom Layer: 68.07,61.25 67.56,-0.72 -1.78,-0.52 -1.53,61.26 -2.03,61.25 -2.03,61.76 -1.52,62.02 -1.52,62.52 67.06,62.78 69.09,61.51

## Text on the board
Bottom Silkscreen Layer: G | FRM | LD1 | LD2 | DT | CL | 3V3 | LS | LED3 | LED4 | GND | +BAT | +5 | NohrPhoto Magic Image Wand 1.3
Top Silkscreen Layer: G | DT | CL | 3V3 | LS | LED3 | LED4 | GND | +BAT | +5
